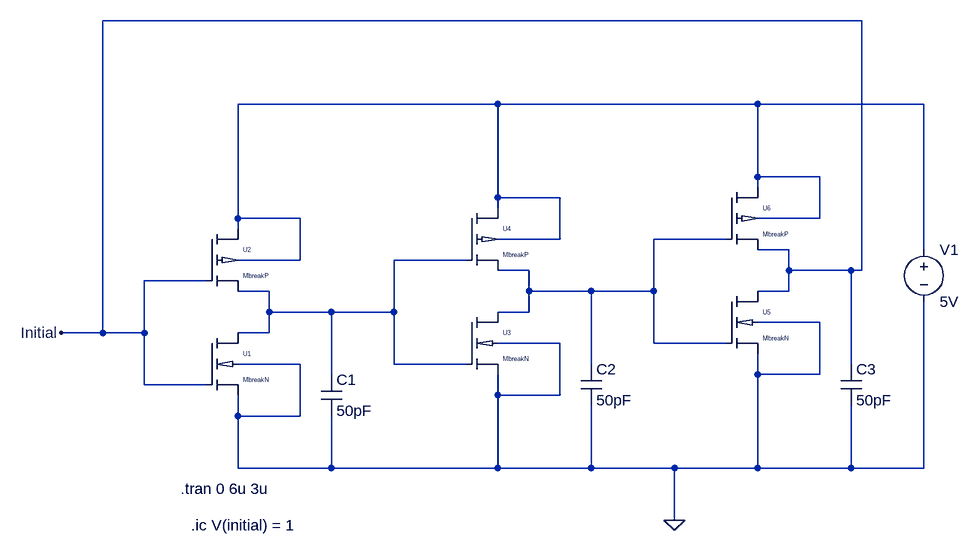
[diagram p0: schematic three_ring_oscillator.asc]
three_ring_oscillator.asc, the LTspice schematic file:
Version 4
SHEET 1 1128 680
WIRE 960 -208 -208 -208
WIRE 400 -80 0 -80
WIRE 800 -80 400 -80
WIRE 1056 -80 800 -80
WIRE 800 32 800 -80
WIRE 896 32 800 32
WIRE 800 48 800 32
WIRE 400 64 400 -80
WIRE 496 64 400 64
WIRE 400 80 400 64
WIRE 0 96 0 -80
WIRE 96 96 0 96
WIRE 896 96 896 32
WIRE 896 96 800 96
WIRE 0 112 0 96
WIRE 496 128 496 64
WIRE 496 128 400 128
WIRE 752 128 640 128
WIRE 848 144 800 144
WIRE 1056 144 1056 -80
WIRE 96 160 96 96
WIRE 96 160 0 160
WIRE 352 160 240 160
WIRE 448 176 400 176
WIRE 848 176 848 144
WIRE 944 176 848 176
WIRE 960 176 960 -208
WIRE 960 176 944 176
WIRE -48 192 -144 192
WIRE 48 208 0 208
WIRE 448 208 448 176
WIRE 544 208 448 208
WIRE 640 208 640 128
WIRE 640 208 544 208
WIRE 848 208 848 176
WIRE 848 208 800 208
WIRE 48 240 48 208
WIRE 144 240 48 240
WIRE 240 240 240 160
WIRE 240 240 144 240
WIRE 448 240 448 208
WIRE 448 240 400 240
WIRE 896 256 800 256
WIRE -208 272 -208 -208
WIRE -208 272 -272 272
WIRE -144 272 -144 192
WIRE -144 272 -208 272
WIRE 48 272 48 240
WIRE 48 272 0 272
WIRE 496 288 400 288
WIRE 640 288 640 208
WIRE 752 288 640 288
WIRE 96 320 0 320
WIRE 240 320 240 240
WIRE 352 320 240 320
WIRE 544 320 544 208
WIRE 944 320 944 176
WIRE 144 336 144 240
WIRE 800 336 800 304
WIRE 896 336 896 256
WIRE 896 336 800 336
WIRE -144 352 -144 272
WIRE -48 352 -144 352
WIRE 400 368 400 336
WIRE 496 368 496 288
WIRE 496 368 400 368
WIRE 0 400 0 368
WIRE 96 400 96 320
WIRE 96 400 0 400
WIRE 0 480 0 400
WIRE 144 480 144 400
WIRE 144 480 0 480
WIRE 400 480 400 368
WIRE 400 480 144 480
WIRE 544 480 544 384
WIRE 544 480 400 480
WIRE 672 480 544 480
WIRE 800 480 800 336
WIRE 800 480 672 480
WIRE 944 480 944 384
WIRE 944 480 800 480
WIRE 1056 480 1056 224
WIRE 1056 480 944 480
WIRE 672 560 672 480
FLAG 672 560 0
FLAG -272 272 Initial
SYMBOL advee_components\\MbreakN -48 272 R0
SYMATTR InstName U1
SYMBOL advee_components\\MbreakP -48 112 R0
SYMATTR InstName U2
SYMBOL advee_components\\MbreakN 352 240 R0
SYMATTR InstName U3
SYMBOL advee_components\\MbreakP 352 80 R0
SYMATTR InstName U4
SYMBOL advee_components\\MbreakN 752 208 R0
SYMATTR InstName U5
SYMBOL advee_components\\MbreakP 752 48 R0
SYMATTR InstName U6
SYMBOL voltage 1056 128 R0
WINDOW 123 0 0 Left 0
WINDOW 39 0 0 Left 0
SYMATTR InstName V1
SYMATTR Value 5V
SYMBOL cap 128 336 R0
SYMATTR InstName C1
SYMATTR Value 50pF
SYMBOL cap 528 320 R0
SYMATTR InstName C2
SYMATTR Value 50pF
SYMBOL cap 928 320 R0
SYMATTR InstName C3
SYMATTR Value 50pF
TEXT -88 512 Left 2 !.tran 0 6u 3u
TEXT -72 568 Left 2 !.ic V(initial) = 1

The netlist it stands for:
* three_ring_oscillator.asc
XU1 N003 Initial 0 0 MbreakN  ; pins D G S B
XU2 N001 Initial N003 N001 MbreakP  ; pins D G S B
XU3 N002 N003 0 0 MbreakN  ; pins D G S B
XU4 N001 N003 N002 N001 MbreakP  ; pins D G S B
XU5 Initial N002 0 0 MbreakN  ; pins D G S B
XU6 N001 N002 Initial N001 MbreakP  ; pins D G S B
V1 N001 0 5V
C1 N003 0 50pF
C2 N002 0 50pF
C3 Initial 0 50pF
.tran 0 6u 3u
.ic V(initial) = 1
.lib AdvEE_Components.lib
.backanno
.end